# Altium schematic sheet SensorInt.SchDoc
size A4
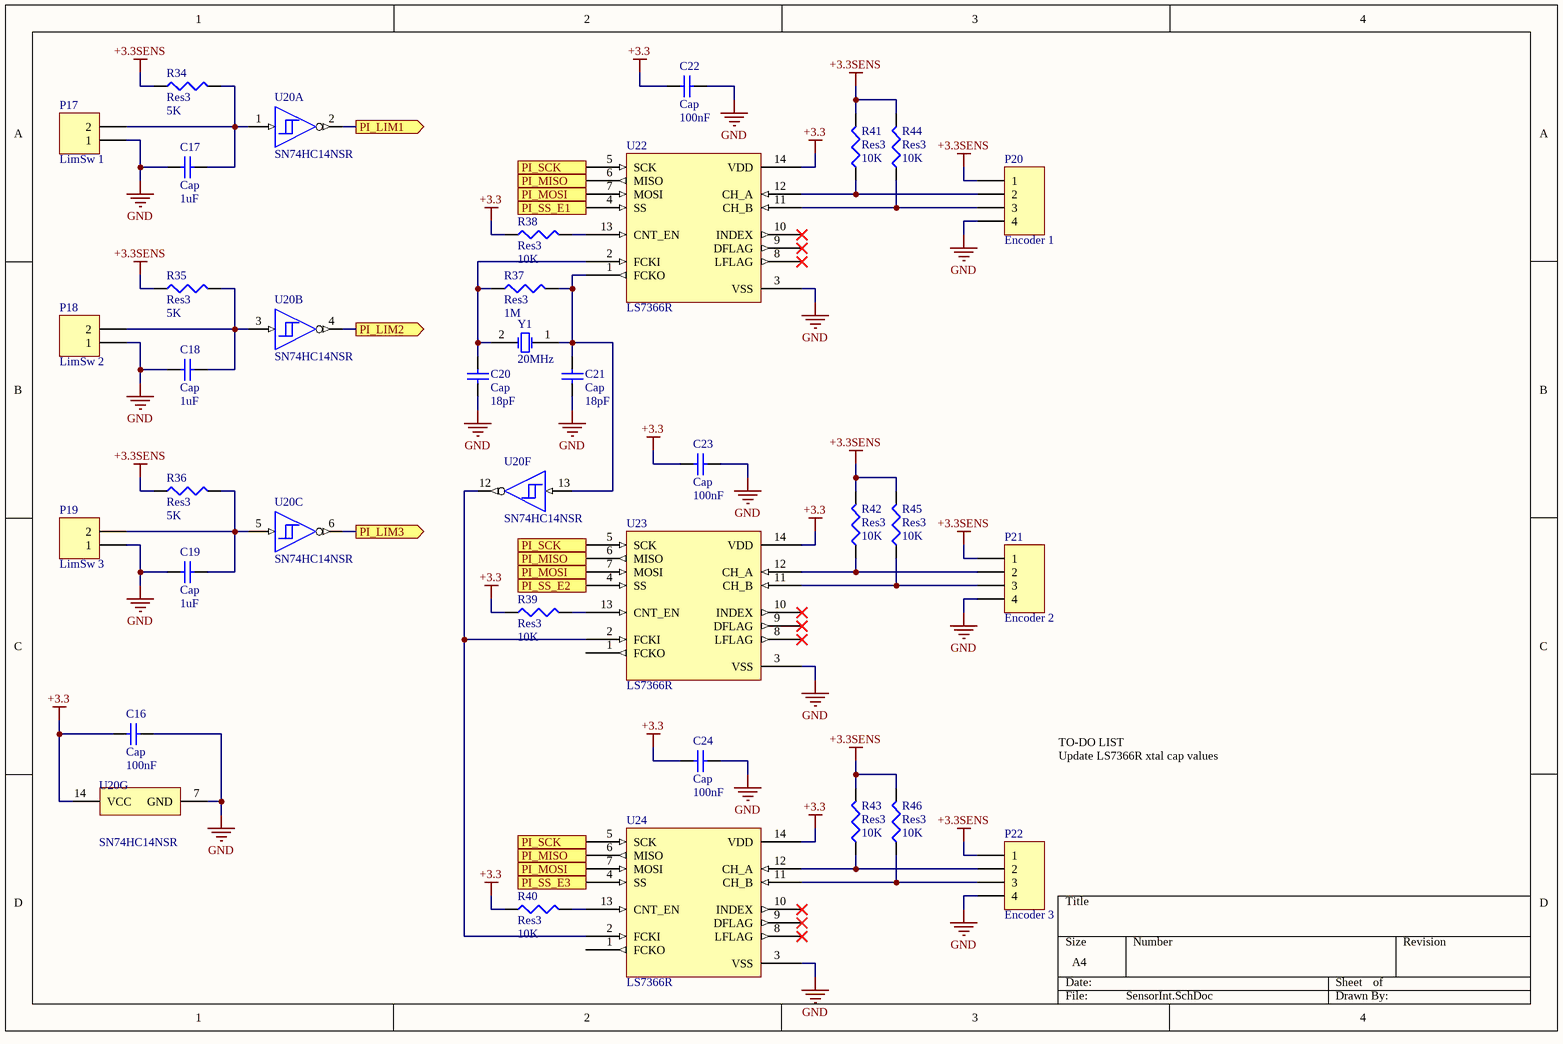
[diagram p0: SensorInt.SchDoc]

## Parts
C16  Cap  value 100nF  [C0805]
C17  Cap  value 1uF  [C0805]
C18  Cap  value 1uF  [C0805]
C19  Cap  value 1uF  [C0805]
C20  Cap  value 18pF  [C0805]
C21  Cap  value 18pF  [C0805]
C22  Cap  value 100nF  [C0805]
C23  Cap  value 100nF  [C0805]
C24  Cap  value 100nF  [C0805]
P17  LimSw 1  [22-23-20x1-2pos]
P18  LimSw 2  [22-23-20x1-2pos]
P19  LimSw 3  [22-23-20x1-2pos]
P20  Encoder 1  [22-23-20x1-4pos]
P21  Encoder 2  [22-23-20x1-4pos]
P22  Encoder 3  [22-23-20x1-4pos]
R34  Res3  value 5K  [C0805]
R35  Res3  value 5K  [C0805]
R36  Res3  value 5K  [C0805]
R37  Res3  value 1M  [C0805]
R38  Res3  value 10K  [C0805]
R39  Res3  value 10K  [C0805]
R40  Res3  value 10K  [C0805]
R41  Res3  value 10K  [C0805]
R42  Res3  value 10K  [C0805]
R43  Res3  value 10K  [C0805]
R44  Res3  value 10K  [C0805]
R45  Res3  value 10K  [C0805]
R46  Res3  value 10K  [C0805]
U20  SN74HC14NSR  [NS0014A_M]  (parts A,B,C,F,G of 7)
U22  LS7366R  [SOIC14N]
U23  LS7366R  [SOIC14N]
U24  LS7366R  [SOIC14N]
Y1  20MHz  [ABM3]

## Ports
PI_LIM1 (out), PI_LIM2 (out), PI_LIM3 (out), PI_MISO (out), PI_MOSI (in), PI_SCK (in), PI_SS_E1 (in), PI_SS_E2 (in), PI_SS_E3 (in)

## Nets
+3.3: C16.1 C22.1 C23.1 C24.1 R38.1 R39.1 R40.1 U20.14(VCC) U22.14(VDD) U23.14(VDD) U24.14(VDD)
+3.3SENS: P20.1 P21.1 P22.1 R34.1 R35.1 R36.1 R41.2 R42.2 R43.2 R44.2 R45.2 R46.2
GND: C16.2 C17.1 C18.1 C19.1 C20.1 C21.1 C22.2 C23.2 C24.2 P17.1 P18.1 P19.1 P20.4 P21.4 P22.4 U20.7(GND) U22.3(VSS) U23.3(VSS) U24.3(VSS)
PI_LIM1: U20.2(~{1Y}) ; port PI_LIM1
PI_LIM2: U20.4(~{2Y}) ; port PI_LIM2
PI_LIM3: U20.6(~{3Y}) ; port PI_LIM3
PI_MISO: U22.6(MISO) U23.6(MISO) U24.6(MISO) ; port PI_MISO
PI_MOSI: U22.7(MOSI) U23.7(MOSI) U24.7(MOSI) ; port PI_MOSI
PI_SCK: U22.5(SCK) U23.5(SCK) U24.5(SCK) ; port PI_SCK
PI_SS_E1: U22.4(SS) ; port PI_SS_E1
PI_SS_E2: U23.4(SS) ; port PI_SS_E2
PI_SS_E3: U24.4(SS) ; port PI_SS_E3
NetC17_2: C17.2 P17.2 R34.2 U20.1(1A)
NetC18_2: C18.2 P18.2 R35.2 U20.3(2A)
NetC19_2: C19.2 P19.2 R36.2 U20.5(3A)
NetC20_2: C20.2 R37.1 U22.2(FCKI) Y1.2(OSC2)
NetC21_2: C21.2 R37.2 U20.13(6A) U22.1(FCKO) Y1.1(OSC1)
NetP20_2: P20.2 R41.1 U22.12(CH_A)
NetP20_3: P20.3 R44.1 U22.11(CH_B)
NetP21_2: P21.2 R42.1 U23.12(CH_A)
NetP21_3: P21.3 R45.1 U23.11(CH_B)
NetP22_2: P22.2 R43.1 U24.12(CH_A)
NetP22_3: P22.3 R46.1 U24.11(CH_B)
NetR38_2: R38.2 U22.13(CNT_EN)
NetR39_2: R39.2 U23.13(CNT_EN)
NetR40_2: R40.2 U24.13(CNT_EN)
NetU20_12: U20.12(~{6Y}) U23.2(FCKI) U24.2(FCKI)

Not connected (* = marked no-connect by the designer): U22 8(LFLAG)* 9(DFLAG)* 10(INDEX)*; U23 1(FCKO) 8(LFLAG)* 9(DFLAG)* 10(INDEX)*; U24 1(FCKO) 8(LFLAG)* 9(DFLAG)* 10(INDEX)*

## Notes on the sheet
- TO-DO LIST
  Update LS7366R xtal cap values

## Library data of the parts
C16-C24 = Cap: Capacitor; Published: 8-Jun-2000; LatestRevisionDate: 17-Jul-2002; LatestRevisionNote: Re-released for DXP Platform.; PackageReference: RAD-0.3; Publisher: Altium Limited; PackageDescription: Radial Cap, Thru-Hole; 2 Leads; 0.3 in Pin Spacing
P17-P19 = Header 2: Header, 2-Pin; LatestRevisionDate: 17-Jul-2002; LatestRevisionNote: Re-released for DXP Platform.; Publisher: Altium Limited
P20-P22 = Header 4: Header, 4-Pin; LatestRevisionDate: 17-Jul-2002; LatestRevisionNote: Re-released for DXP Platform.; Publisher: Altium Limited
R34-R46 = Res3: Resistor; Published: 8-Jun-2000; LatestRevisionDate: 29-May-2009; LatestRevisionNote: IPC-7351 Footprint Added.; PackageReference: J1-0603; Publisher: Altium Limited; PackageDescription: Chip Resistor
U20 = CMP-1615-00079-5: Hex Schmitt-Trigger Inverters, NS0014A, LARGE T&R; Manufacturer: Texas Instruments; VCC(Min)(V): 2; F @ Nom Voltage(Max)(Mhz): 20; Bits(#): 6; Output Drive (IOL/IOH)(Max)(mA): -4/4; ICC @ Nom Voltage(Max)(mA): 0.02; Rating: Catalog; Technology Family: HC; Input Type: CMOS; tpd @ Nom Voltage(Max)(ns): 31; Voltage(Nom)(V): 5; Schmitt Trigger: Yes; Operating Temperature Range(C): -40 to 85; VCC(Max)(V): 6; Generic Part Number: SN74HC14; PackageReference: NS0014A; DatasheetVersion: SCLS085G; Output Type: CMOS
U22-U24 = LS7366R: 32-BIT QUADRATURE COUNTER WITH SERIAL INTERFACE; ComponentLink1Description: Datasheet; ComponentLink1URL: https://lsicsi.com/pdfs/Data_Sheets/LS7366R.pdf
Y1 = XTAL: Crystal Oscillator; Published: 8-Jun-2000; LatestRevisionDate: 17-Jul-2002; LatestRevisionNote: Re-released for DXP Platform.; PackageReference: R38; Publisher: Altium Limited; PackageDescription: Crystal, Thru-Hole; 2 Leads; Body 3.1 x 8.2 mm (Dia.xH)